# Altium schematic sheet SER_24.SchDoc
size A
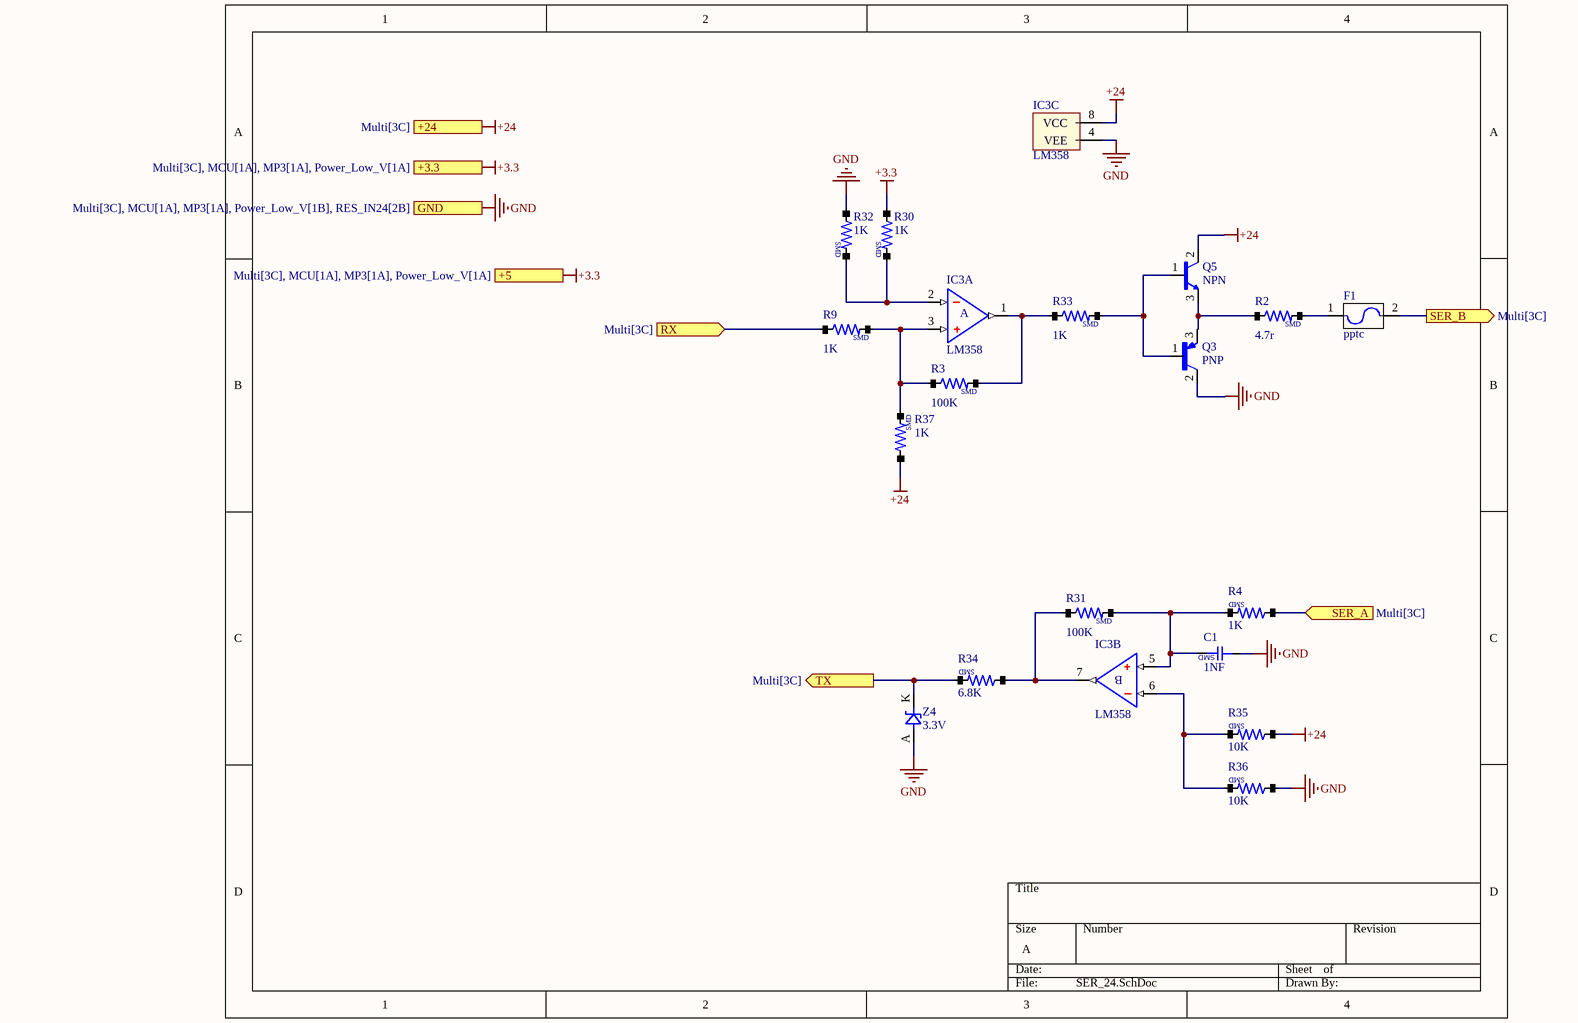
[diagram p0: SER_24.SchDoc]

## Parts
C1  1NF  [CAP-0603]
F1  pptc  [PPTC]
IC3  LM358  [SOP-8]  (parts A,B,C of 3)
Q3  PNP  [SOT-89]
Q5  NPN  [SOT-89]
R2  4.7r  [RES/0805]
R3  100K  [RES/0603]
R4  1K  [RES/0603]
R9  1K  [RES/0603]
R30  1K  [RES/0603]
R31  100K  [RES/0603]
R32  1K  [RES/0603]
R33  1K  [RES/0603]
R34  6.8K  [RES/0805]
R35  10K  [RES/0603]
R36  10K  [RES/0603]
R37  1K  [RES/0603]
Z4  3.3V  [DIOD/RS1J]

## Ports
+3.3 (see Multi[3C], MCU[1A], MP3[1A], Power_Low_V[1A]), +5 (see Multi[3C], MCU[1A], MP3[1A], Power_Low_V[1A]), +24 (see Multi[3C]), GND (see Multi[3C], MCU[1A], MP3[1A], Power_Low_V[1B], RES_IN24[2B]), RX (in, see Multi[3C]), SER_A (in, see Multi[3C]), SER_B (out, see Multi[3C]), TX (out, see Multi[3C])

## Nets
+3.3: R30.1 ; port +3.3, port +5
+24: IC3.8(VCC) Q5.2(C) R35.1 R37.1 ; port +24
GND: C1.1 IC3.4(VEE) Q3.2(C) R32.1 R36.1 Z4.A ; port GND
RX: R9.1 ; port RX
SER_A: R4.1 ; port SER_A
SER_B: F1.2 ; port SER_B
TX: R34.2 Z4.K ; port TX
NetC1_2: C1.2 IC3.5 R4.2 R31.2
NetF1_1: F1.1 R2.2
NetIC3_1: IC3.1 R3.2 R33.1
NetIC3_2: IC3.2 R30.2 R32.2
NetIC3_3: IC3.3 R3.1 R9.2 R37.2
NetIC3_6: IC3.6 R35.2 R36.2
NetIC3_7: IC3.7 R31.1 R34.1
NetQ3_1: Q3.1(B) Q5.1(B) R33.2
NetQ3_3: Q3.3(E) Q5.3(E) R2.1

## Notes on the sheet
- (in symbol cap_smd) SMD
- (in symbol LM358, part A) A
- (in symbol LM358, part B) B
- (in symbol RES/SMD) SMD

## Library data of the parts
C1 = cap_smd
F1 = fuze
R2-R4 R9 R30-R37 = RES/SMD
Z4 = zener-0.5w